# EAGLE schematic SchematicLickportPCB (EAGLE 9.7.0)
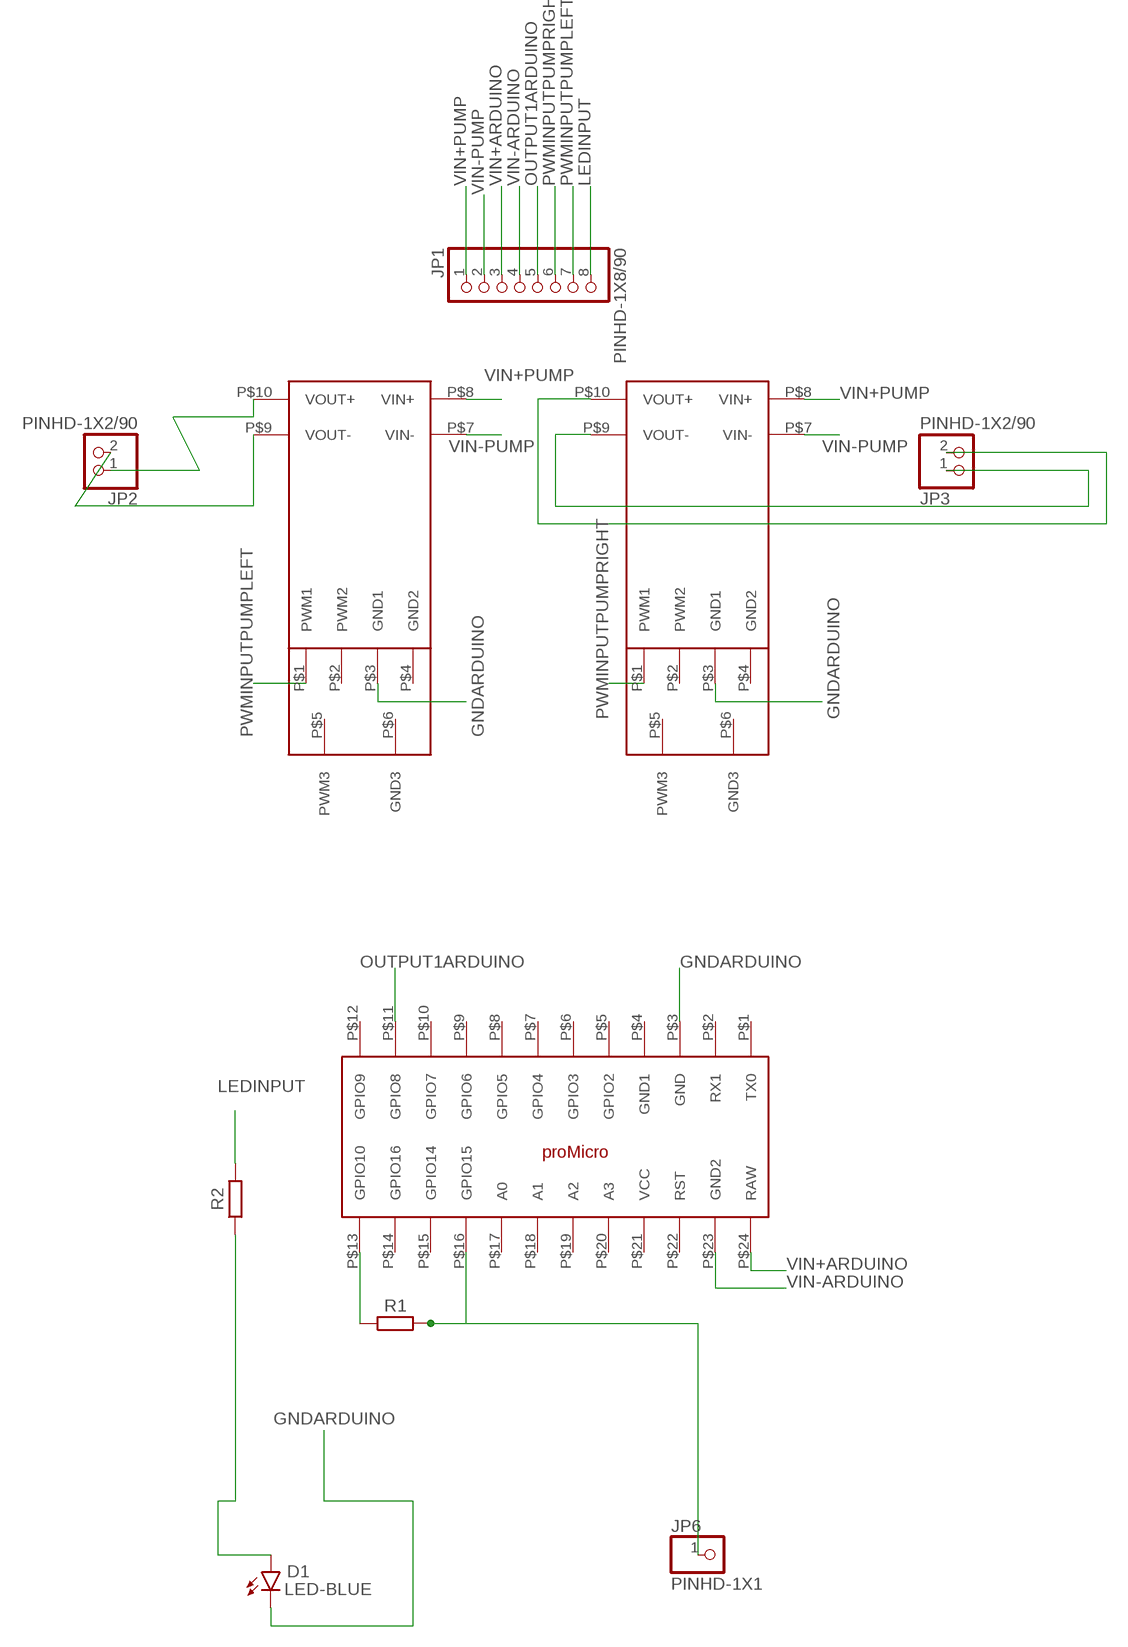
[diagram p0: schematic, sheet 1]

## Parts
D1  LED-BLUE  LED_RADIALBLUE  [LEDRD254W60D565H860B_B]
JP1  PINHD-1X8/90  [1X08/90]
JP2  PINHD-1X2/90  [1X02/90]
JP3  PINHD-1X2/90  [1X02/90]
JP6  PINHD-1X1  [1X01]
R1  RESISTOR_AXIAL-11.7MM-PITCH  [RESAD1176W63L850D250B]
R2  RESISTOR_AXIAL-11.7MM-PITCH  [RESAD1176W63L850D250B]
U$1  MOSFET_MODULE  [MOSFET_MODULE]
U$2  MOSFET_MODULE  [MOSFET_MODULE]
U$3  JOY_IT_PRO_MICRO  [JOY_IT_PRO_MICRO]

## Nets
GNDARDUINO: D1.C U$1.P$3(GND1) U$2.P$3(GND1) U$3.P$3(GND)
LEDINPUT: JP1.8 R2.2
N$9: JP2.1 U$1.P$10(VOUT+)
N$10: JP2.2 U$1.P$9(VOUT-)
N$17: JP3.2 U$2.P$10(VOUT+)
N$18: JP3.1 U$2.P$9(VOUT-)
N$24: D1.A R2.1
N$26: R1.1 U$3.P$13(GPIO10)
N$27: JP6.1 R1.2 U$3.P$16(GPIO15)
OUTPUT1ARDUINO: JP1.5 U$3.P$11(GPIO8)
PWMINPUTPUMPLEFT: JP1.7 U$1.P$1(PWM1)
PWMINPUTPUMPRIGHT: JP1.6 U$2.P$1(PWM1)
VIN+ARDUINO: JP1.3 U$3.P$24(RAW)
VIN+PUMP: JP1.1 U$1.P$8(VIN+) U$2.P$8(VIN+)
VIN-ARDUINO: JP1.4 U$3.P$23(GND2)
VIN-PUMP: JP1.2 U$1.P$7(VIN-) U$2.P$7(VIN-)
Unconnected: U$1.P$2(PWM2) U$1.P$4(GND2) U$1.P$5(PWM3) U$1.P$6(GND3) U$2.P$2(PWM2) U$2.P$4(GND2) U$2.P$5(PWM3) U$2.P$6(GND3) U$3.P$1(TX0) U$3.P$2(RX1) U$3.P$4(GND1) U$3.P$5(GPIO2) U$3.P$6(GPIO3) U$3.P$7(GPIO4) U$3.P$8(GPIO5) U$3.P$9(GPIO6) U$3.P$10(GPIO7) U$3.P$12(GPIO9) U$3.P$14(GPIO16) U$3.P$15(GPIO14) U$3.P$17(A0) U$3.P$18(A1) U$3.P$19(A2) U$3.P$20(A3) U$3.P$21(VCC) U$3.P$22(RST)

## Library data of the parts
D1 = Opto-Electronic:LED_RADIAL: LED - Generic
JP1 = LickportLibrary:PINHD-1X8: PIN HEADER; CATEGORY: Headers; DESCRIPTION: Header, Right Angle, 8 Position; MANUFACTURER: Generic; MPN: Generic; OPERATING_TEMPERATURE: Generic; PART_STATUS: Active; PITCH: 0.100" (2.54mm); ROHS_COMPLIANCE: Generic; SERIES: Generic; SUB-CATEGORY: Headers, Male Pins; TYPE: Board to Board or Cable, Unshrouded, Through Hole, Right Angle
JP2 JP3 = LickportLibrary:PINHD-1X2: PIN HEADER; CATEGORY: Headers; DESCRIPTION: Header, Right Angle, 2 Position; MANUFACTURER: Generic; MPN: Generic; OPERATING_TEMPERATURE: Generic; PART_STATUS: Active; PITCH: 0.100" (2.54mm); ROHS_COMPLIANCE: Generic; SERIES: Generic; SUB-CATEGORY: Headers, Male Pins; TYPE: Board to Board or Cable, Unshrouded, Through Hole, Right Angle
JP6 = Connector:PINHD-1X1: PIN HEADER; CATEGORY: Headers; DESCRIPTION: Header, Straight, 1 Position; MANUFACTURER: Generic; MPN: Generic; OPERATING_TEMPERATURE: Generic; PART_STATUS: Active; PITCH: 0.100" (2.54mm); ROHS_COMPLIANCE: Generic; SERIES: Generic; SUB-CATEGORY: Headers, Male Pins; TYPE: Board to Board or Cable, Unshrouded, Through Hole, Straight
R1 R2 = LickportLibrary:RESISTOR: Resistor Fixed - Generic; CATEGORY: Resistor; SUB-CATEGORY: Fixed
U$1 U$2 = LickportLibrary:MOSFET_MODULE
U$3 = LickportLibrary:JOY_IT_PRO_MICRO